# Altium schematic sheet PWM.SchDoc: PWM
size OrCAD A; DocumentNumber: LM-003; Revision: 3.0; SheetNumber: 4; SheetTotal: 11
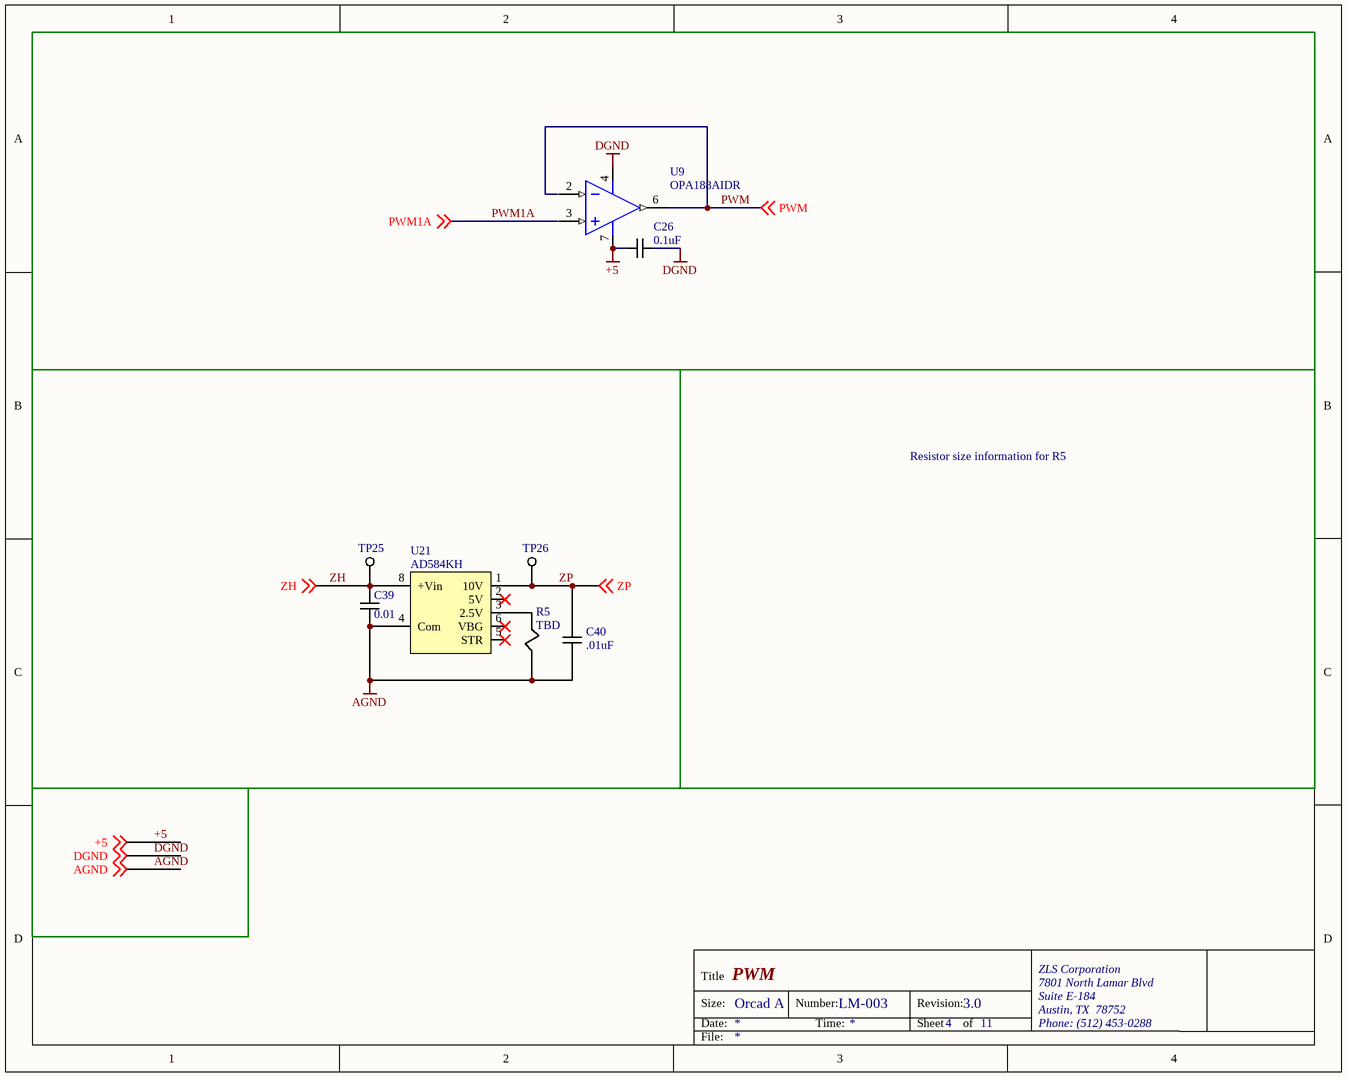
[diagram p0: PWM.SchDoc]

## Parts
C26  0.1uF
C39  0.01  [RAD-0.1]
C40  .01uF
R5  TBD
TP25  (no value)  [TESTPOINT .45]
TP26  (no value)
U9  OPA188AIDR
U21  AD584KH

## Nets
+5: C26.1 U9.7(+VS) ; off-sheet +5
AGND: C39.2 C40.2 R5.1 U21.4(Com) ; off-sheet AGND
DGND: C26.2 U9.4(-VS) ; off-sheet DGND
PWM: U9.6(-IN) ; off-sheet PWM
ZH: C39.1 TP25.1 U21.8(+Vin) ; off-sheet ZH
ZP: C40.1 TP26.1 U21.1(10V) ; off-sheet ZP
NetR5_2: R5.2 U21.3(2.5V)

Not connected (* = marked no-connect by the designer): U9 2(-IN_A) 3(+IN_A); U21 2(5V)* 5(STR)* 6(VBG)*

## Notes on the sheet
- Resistor size information for R5
- Title
- Size:
- Date:
- Orcad A
- Number:
- Time:
- Revision:
- Sheet
- of
- ZLS Corporation
- 7801 North Lamar Blvd
- Suite E-184
- Austin, TX  78752
- Phone: (512) 453-0288
- File:

## Library data of the parts
C26 = CAP B: CAP CER 0.1UF 25V X7R 0805; Manufacturer 1: Murata Electronics North America; Manufacturer Part Number 1: GRM21BR71E104KA01L; Category 1: Capacitors; Capacitance: 0.1µF; Tolerance: ±10%; Supplier 1: Digi-Key; Supplier Part Number 1: 490-1673-1-ND; RoHS 1: RoHS Compliant; Description 1: CAP CER 0.1UF 25V X7R 0805; Stock 1: 897437; Pricing 1: 1=0.2, 10=0.145, 25=0.106, 50=0.0824, 100=0.0683, 250=0.05652, 500=0.04788, 1000=0.03964 (USD); Packaging: Cut Tape (CT); Part Status: Active; Voltage - Rated: 25V; Temperature Coefficient: X7R; Operating Temperature: -55°C ~ 125°C; Features: -; Ratings: -; Applications: General Purpose; Mounting Type: Surface Mount, MLCC; Package / Case: 0805 (2012 Metric); Size / Dimension: 0.079" L x 0.049" W (2.00mm x 1.25mm); Height - Seated (Max): -; Thickness (Max): 0.053" (1.35mm); Lead Spacing: -; Lead Style: -; ComponentLink1URL: http://www.murata.com/~/media/webrenewal/support/library/catalog/products/capacitor/mlcc/c02e.ashx; ComponentLink1Description: http://www.murata.com/~/media/webrenewal/support/library/catalog/products/capacitor/mlcc/c02e.ashx
C39 = CAP B: CAP CER 10000PF 50V 10% X7R 0402; Manufacturer 1: Murata Electronics North America; Manufacturer Part Number 1: GRM155R71H103KA88D; Category 1: Capacitors; Supplier 1: Digi-Key; Supplier Part Number 1: 490-4516-2-ND; RoHS 1: RoHS Compliant; Description 1: CAP CER 10000PF 50V 10% X7R 0402; Stock 1: 652600; Pricing 1: 10000=0.00372, 20000=0.00354, 30000=0.00336, 50000=0.00301, 100000=0.00243 (USD); Packaging: Tape & Reel (TR); Capacitance: 10000pF; Tolerance: ±10%; Voltage - Rated: 50V; Temperature Coefficient: X7R; Mounting Type: Surface Mount, MLCC; Operating Temperature: -55°C ~ 125°C; Applications: General Purpose; Ratings: -; Package / Case: 0402 (1005 Metric); Size / Dimension: 0.039" L x 0.020" W (1.00mm x 0.50mm); Height - Seated (Max): -; Thickness (Max): 0.022" (0.55mm); Lead Spacing: -; Features: -; Lead Style: -; ComponentLink1URL: http://www.murata.com/products/catalog/pdf/c02e.pdf; ComponentLink1Description: http://www.murata.com/products/catalog/pdf/c02e.pdf
C40 = CAP B: CAP CER 10000PF 50V X7R 0805; Manufacturer 1: Murata Electronics North America; Manufacturer Part Number 1: GRM216R71H103KA01D; Category 1: Capacitors; Tolerance: ±10%; Supplier 1: Digi-Key; Supplier Part Number 1: 490-1664-1-ND; RoHS 1: RoHS Compliant; Description 1: CAP CER 10000PF 50V X7R 0805; Stock 1: 1003025; Pricing 1: 1=0.1, 10=0.072, 25=0.052, 50=0.0392, 100=0.032, 250=0.02672, 500=0.02282, 1000=0.01793 (USD); Packaging: Cut Tape (CT); Part Status: Active; Capacitance: 10000pF; Voltage - Rated: 50V; Temperature Coefficient: X7R; Operating Temperature: -55°C ~ 125°C; Features: -; Ratings: -; Applications: General Purpose; Mounting Type: Surface Mount, MLCC; Package / Case: 0805 (2012 Metric); Size / Dimension: 0.079" L x 0.049" W (2.00mm x 1.25mm); Height - Seated (Max): -; Thickness (Max): 0.028" (0.70mm); Lead Spacing: -; Lead Style: -; ComponentLink1URL: http://www.murata.com/~/media/webrenewal/support/library/catalog/products/capacitor/mlcc/c02e.ashx; ComponentLink1Description: http://www.murata.com/~/media/webrenewal/support/library/catalog/products/capacitor/mlcc/c02e.ashx
R5 = RES1: RES TBD OHM 0.3W 1% RADIAL; Category 1: Resistors; Description 1: RES TBD OHM 0.3W 1% RADIAL; ComponentLink1URL: http://www.vishaypg.com/docs/63004/vh.pdf
TP25 = TESTPOINT A
TP26 = TESTPOINT A: TEST POINT PC MINI .040"D BLACK; Manufacturer 1: Keystone Electronics; Manufacturer Part Number 1: 5001; Category 1: Test and Measurement; Plating: Silver; Material - Insulation: Nylon 46, UL 94V-0; Material - Body: Phosphor Bronze; Supplier 1: Digi-Key; Supplier Part Number 1: 36-5001-ND; RoHS 1: RoHS Compliant; Description 1: TEST POINT PC MINI .040"D BLACK; Stock 1: 883882; Pricing 1: 1=0.37, 10=0.316, 50=0.2298, 100=0.2209, 250=0.19832, 500=0.18932, 1000=0.1616, 2500=0.14424, 5000=0.13523 (USD); Packaging: Bulk; Part Status: Active; Type: PC Test Point, Miniature; Mounting Type: 0.040" (1.02mm) Hole Diameter; Color: Black; Size / Dimension: 0.100" Dia x 0.180" L (2.54mm x 4.57mm); Height: -; ComponentLink1URL: http://www.keyelco.com/product-pdf.cfm?p=1310; ComponentLink1Description: http://www.keyelco.com/product-pdf.cfm?p=1310
U9 = OPA188AIDR: Manufacturer 1: Texas Instruments; Description 1: Precision Amplifiers Prec,Low Noise,RRO 36V 0-Drift Op Amp; Manufacturer Part Number 1: OPA188AIDR; ComponentLinkURL: http://www.ti.com/lit/ds/symlink/opa188.pdf; Package/ Case: SOIC-8; Packaging: Reel; Supplier 1: Mouser; Supplier Part Number 1: 595-OPA188AIDR
U21 = VOLTAGE REF, AD584KH: IC VREF SERIES PROG TO99-8; Manufacturer 1: Analog Devices Inc.; Category 1: Integrated Circuits (ICs); Output Type: Programmable; Voltage - Output (Min/Fixed): 2.5V, 5V, 7.5V, 10V; Current - Output: 10mA; Tolerance: ±0.1%; Temperature Coefficient: 15ppm/°C; Noise - 0.1Hz to 10Hz: 50µVp-p; Voltage - Input: 4.5 V ~ 30 V; Current - Supply: 1mA; Supplier 1: Digi-Key; Supplier Part Number 1: AD584KH-ND; Manufacturer Part Number 1: AD584KH; RoHS 1: RoHS non-compliant; Description 1: IC VREF SERIES PROG TO99-8; Stock 1: 133; Pricing 1: 1=30.28, 10=27.928, 100=23.8488 (USD); Packaging: Bulk; Part Status: Active; Reference Type: Series; Voltage - Output (Max): -; Noise - 10Hz to 10kHz: -; Current - Cathode: -; Operating Temperature: 0°C ~ 70°C (TA); Mounting Type: Through Hole; Package / Case: TO-99-8 Metal Can; Supplier Device Package: TO-99-8; ComponentLink1URL: http://www.analog.com/media/en/technical-documentation/data-sheets/AD584.pdf; ComponentLink1Description: http://www.analog.com/media/en/technical-documentation/data-sheets/AD584.pdf